# EAGLE design Universal Debugger Module (EAGLE 6.3)
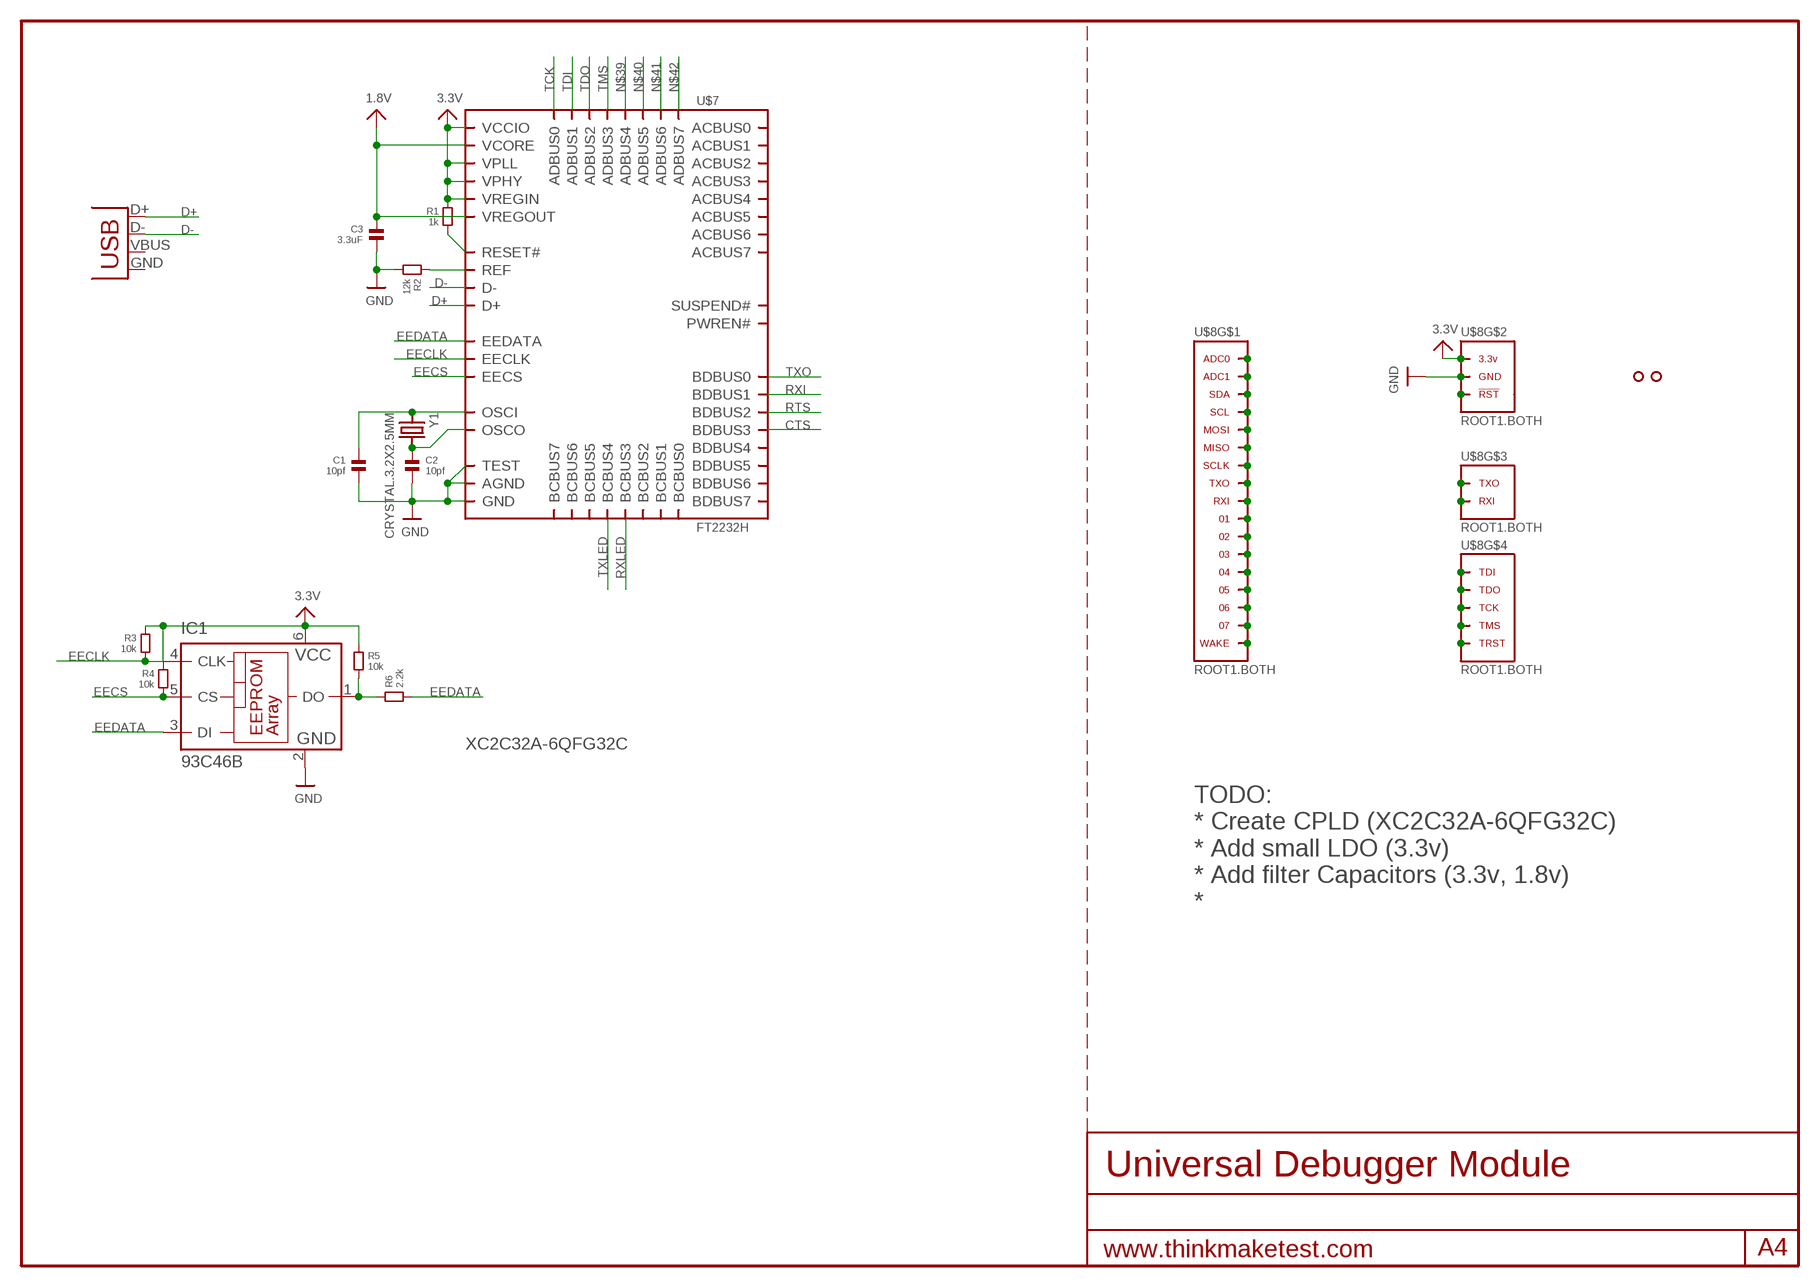
[diagram p0: schematic, sheet 1]

## Parts
C1  10pf  CAPACITOR.0603  [0603]
C2  10pf  CAPACITOR.0603  [0603]
C3  3.3uF  CAPACITOR.0603  [0603]
IC1  93C46B  93C76A  [SOT23-6]
R1  1k  RESISTOR.0603  [0603]
R2  12k  RESISTOR.0603  [0603]
R3  10k  RESISTOR.0603  [0603]
R4  10k  RESISTOR.0603  [0603]
R5  10k  RESISTOR.0603  [0603]
R6  2.2k  RESISTOR.0603  [0603]
U$3  HOLE.2MM  [2MM]
U$4  HOLE.2MM  [2MM]
U$7  FT2232H  [QFN64.PAD]
U$8  ROOT1.BOTH  [ROOT1.BOTH]
X1  USB-MICROB  [USB-MICROB]
Y1  CRYSTAL.3.2X2.5MM  [3.2X2.5MM]

## Nets
1.8V: C3.1 U$7.12(VCORE) U$7.37(VCORE) U$7.49(VREGOUT) U$7.64(VCORE)
3.3V: IC1.6(VCC) R1.1 R3.1 R4.1 R5.1 U$7.4(VPHY) U$7.9(VPLL) U$7.20(VCCIO) U$7.31(VCCIO) U$7.42(VCCIO) U$7.50(VREGIN) U$7.56(VCCIO) U$8.3.3V@1(3.3V) U$8.3.3V@2(3.3V) U$8.3.3V@3(3.3V) U$8.3.3V@4(3.3V) U$8.3.3V@5(3.3V) U$8.3.3V@6(3.3V) U$8.3.3V@7(3.3V) U$8.3.3V@8(3.3V) U$8.3.3V@9(3.3V) U$8.3.3V@10(3.3V) U$8.3.3V@11(3.3V) U$8.3.3V@12(3.3V) U$8.3.3V@13(3.3V) U$8.3.3V@14(3.3V) U$8.3.3V@15(3.3V) U$8.3.3V@16(3.3V) U$8.3.3V@17(3.3V) U$8.3.3V@18(3.3V) U$8.3.3V@19(3.3V) U$8.3.3V@20(3.3V) U$8.3.3V@21(3.3V) U$8.3.3V@22(3.3V) U$8.3.3V@23(3.3V) U$8.3.3V@24(3.3V) U$8.3.3V@VIA(3.3V)
CTS: U$7.41(BDBUS3)
D+: U$7.8(D+) X1.D+
D-: U$7.7(D-) X1.D-
EECLK: IC1.4(CLK) R3.2 U$7.62(EECLK)
EECS: IC1.5(CS) R4.2 U$7.63(EECS)
EEDATA: IC1.3(DI) R6.2 U$7.61(EEDATA)
GND: C1.2 C2.2 C3.2 IC1.2(GND) R2.2 U$7.1(GND) U$7.5(GND) U$7.10(AGND) U$7.11(GND) U$7.13(TEST) U$7.15(GND) U$7.25(GND) U$7.35(GND) U$7.47(GND) U$7.51(GND) U$7.PAD(GND) U$8.GND@1(GND) U$8.GND@2(GND) U$8.GND@3(GND) U$8.GND@4(GND) U$8.GND@5(GND) U$8.GND@6(GND) U$8.GND@7(GND) U$8.GND@8(GND) U$8.GND@9(GND) U$8.GND@10(GND) U$8.GND@11(GND) U$8.GND@12(GND) U$8.GND@13(GND) U$8.GND@14(GND) U$8.GND@15(GND) U$8.GND@16(GND) U$8.GND@17(GND) U$8.GND@18(GND) U$8.GND@19(GND) U$8.GND@20(GND) U$8.GND@21(GND) U$8.GND@22(GND) U$8.GND@23(GND) U$8.GND@24(GND) U$8.GND@25(GND) U$8.GND@26(GND) U$8.GND@VIA(GND)
N$1: U$8.ADC0 U$8.ADC0@1(ADC0) U$8.ADC0@VIA(ADC0)
N$2: U$8.ADC1 U$8.ADC1@1(ADC1) U$8.ADC1@VIA(ADC1)
N$3: U$8.SDA U$8.SDA@1(SDA) U$8.SDA@VIA(SDA)
N$4: U$8.SCL U$8.SCL@1(SCL) U$8.SCL@VIA(SCL)
N$5: U$8.MOSI U$8.MOSI@1(MOSI) U$8.MOSI@VIA(MOSI)
N$6: U$8.MISO U$8.MISO@1(MISO) U$8.MISO@VIA(MISO)
N$7: U$8.SCLK U$8.SCLK@1(SCLK) U$8.SCLK@VIA(SCLK)
N$8: U$8.01 U$8.01@1 U$8.01@VIA
N$9: U$8.02 U$8.02@1 U$8.02@VIA
N$10: U$8.03 U$8.03@1 U$8.03@VIA
N$11: U$8.04 U$8.04@1 U$8.04@VIA
N$12: U$8.05 U$8.05@1 U$8.05@VIA
N$13: U$8.06 U$8.06@1 U$8.06@VIA
N$14: U$8.07 U$8.07@1 U$8.07@VIA
N$15: U$8.WAKE U$8.WAKE@1(WAKE) U$8.WAKE@VIA(WAKE)
N$16: U$8.RXI U$8.RXI@1(RXI) U$8.RXI@VIA(RXI)
N$17: U$8.TXO U$8.TXO@1(TXO) U$8.TXO@VIA(TXO)
N$18: C2.1 U$7.3(OSCO) Y1.3
N$19: U$8.RST(!RST) U$8.RST@1(!RST) U$8.RST@VIA(!RST)
N$20: C1.1 U$7.2(OSCI) Y1.1
N$23: U$8.TRST U$8.TRST@1(TRST) U$8.TRST@VIA(TRST)
N$25: U$8.TMS U$8.TMS@1(TMS) U$8.TMS@VIA(TMS)
N$26: U$8.TCK U$8.TCK@1(TCK) U$8.TCK@VIA(TCK)
N$27: U$8.TDO U$8.TDO@1(TDO) U$8.TDO@VIA(TDO)
N$28: U$8.TDI U$8.TDI@1(TDI) U$8.TDI@VIA(TDI)
N$29: U$8.RXI.DBG(RXI) U$8.RXI.DBG@1(RXI) U$8.RXI.DBG@VIA(RXI)
N$31: U$8.TXO.DBG(TXO) U$8.TXO.DBG@1(TXO) U$8.TXO.DBG@VIA(TXO)
N$32: R2.1 U$7.6(REF)
N$33: R1.2 U$7.14(RESET#)
N$34: IC1.1(DO) R5.2 R6.1
N$39: U$7.21(ADBUS4)
N$40: U$7.22(ADBUS5)
N$41: U$7.23(ADBUS6)
N$42: U$7.24(ADBUS7)
RTS: U$7.40(BDBUS2)
RXI: U$7.39(BDBUS1)
RXLED: U$7.54(BCBUS3)
TCK: U$7.16(ADBUS0)
TDI: U$7.17(ADBUS1)
TDO: U$7.18(ADBUS2)
TMS: U$7.19(ADBUS3)
TXLED: U$7.55(BCBUS4)
TXO: U$7.38(BDBUS0)
Unconnected: U$7.26(ACBUS0) U$7.27(ACBUS1) U$7.28(ACBUS2) U$7.29(ACBUS3) U$7.30(ACBUS4) U$7.32(ACBUS5) U$7.33(ACBUS6) U$7.34(ACBUS7) U$7.36(SUSPEND#) U$7.43(BDBUS4) U$7.44(BDBUS5) U$7.45(BDBUS6) U$7.46(BDBUS7) U$7.48(BCBUS0) U$7.52(BCBUS1) U$7.53(BCBUS2) U$7.57(BCBUS5) U$7.58(BCBUS6) U$7.59(BCBUS7) U$7.60(PWREN#) X1.GND X1.VBUS

## Notes on the sheet
- XC2C32A-6QFG32C
- TODO:
  * Create CPLD (XC2C32A-6QFG32C)
  * Add small LDO (3.3v)
  * Add filter Capacitors (3.3v, 1.8v)
  *

## Library data of the parts
C1-C3 = .standardparts:CAPACITOR
IC1 = microchip:93*76?: 8K Microwire Compatible Serial EEPROM Source: http://ww1.microchip.com/downloads/en/DeviceDoc/21796H.pdf; OC_FARNELL: unknown; OC_NEWARK: unknown
R1-R6 = .standardparts:RESISTOR
U$3 U$4 = .screw_holes:HOLE
U$7 = ftdi:FT2232H
U$8 = thinkmaketest:ROOT1
X1 = SparkFun:USB: USB Connectors USB-B-PTH is fully proven SKU : PRT-00139 USB-miniB is fully proven SKU : PRT-00587 USB-A-PCB is untested. USB-A-H is throughly reviewed, but untested. Spark Fun Electronics SKU : PRT-00437 USB-B-SMT is throughly reviewed, but untested. Needs silkscreen touching up. USB-A-S has not been used/tested USB-MB-H has not been used/tested
Y1 = abracon:CRYSTAL

## Board
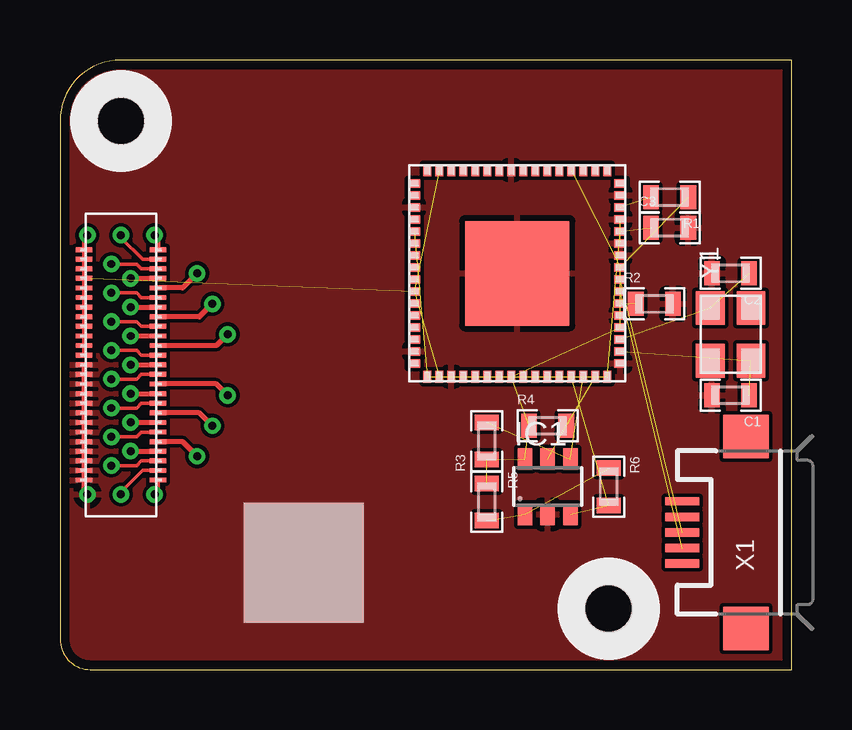
[diagram p1: board, top side]
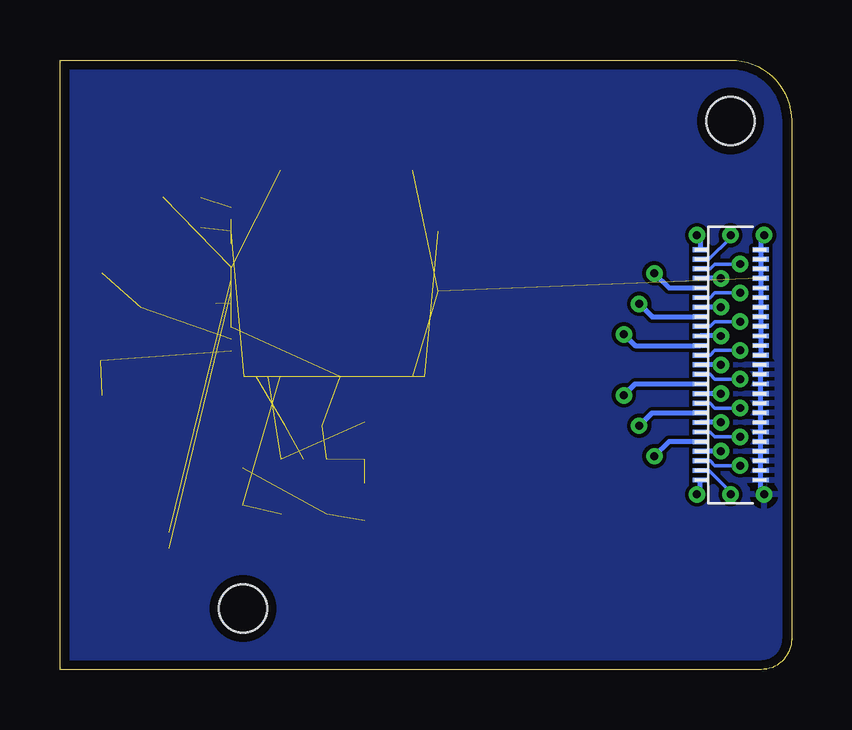
[diagram p2: board, bottom side, seen from below]

Size 30.48 x 25.4 mm. Coordinates in mm from the lower left corner, seen from the top.
Outline: 0,22.86 0,1.27 arc90 1.27,0 30.48,0 30.48,25.4 2.54,25.4 arc90 0,22.86
Copper layers (1*16): Top 0.0356mm / dielectric 1.5011mm / Bottom 0.0356mm
Design rules "default": minimum track width 6mil, minimum drill 13mil, track to track 6mil, track to pad 6mil, pad to pad 6mil, via to via 6mil, smd to smd 6mil, copper to edge 15mil, drill to drill 6mil, minimum pad ring 7mil, minimum via ring 7mil, stop-mask expansion 4mil, vias tented up to drill 16mil, thermal gap 10mil

### Footprints (pad centres in the part's own frame; a part is rotated, then mirrored left to right if it is on the bottom)
0603 = smd 0.65 x 1: 1 -0.775,0; 2 0.775,0
SOT23-6 = smd 0.6 x 0.9: 1 -0.95,-1.15; 2 0,-1.15; 3 0.95,-1.15; 4 0.95,1.15; 5 0,1.15; 6 -0.95,1.15
2MM = hole 2: 0,0
QFN64.PAD = smd 0.5 x 0.35: 1 -4.3,3.75; 2 -4.3,3.25; 3 -4.3,2.75; 4 -4.3,2.25; 5 -4.3,1.75; 6 -4.3,1.25; 7 -4.3,0.75; 8 -4.3,0.25; 9 -4.3,-0.25; 10 -4.3,-0.75; 11 -4.3,-1.25; 12 -4.3,-1.75; 13 -4.3,-2.25; 14 -4.3,-2.75; 15 -4.3,-3.25; 16 -4.3,-3.75; 33 4.3,-3.75; 34 4.3,-3.25; 35 4.3,-2.75; 36 4.3,-2.25; 37 4.3,-1.75; 38 4.3,-1.25; 39 4.3,-0.75; 40 4.3,-0.25; 41 4.3,0.25; 42 4.3,0.75; 43 4.3,1.25; 44 4.3,1.75; 45 4.3,2.25; 46 4.3,2.75; 47 4.3,3.25; 48 4.3,3.75 | smd 0.35 x 0.5: 17 -3.75,-4.3; 18 -3.25,-4.3; 19 -2.75,-4.3; 20 -2.25,-4.3; 21 -1.75,-4.3; 22 -1.25,-4.3; 23 -0.75,-4.3; 24 -0.25,-4.3; 25 0.25,-4.3; 26 0.75,-4.3; 27 1.25,-4.3; 28 1.75,-4.3; 29 2.25,-4.3; 30 2.75,-4.3; 31 3.25,-4.3; 32 3.75,-4.3; 49 3.75,4.3; 50 3.25,4.3; 51 2.75,4.3; 52 2.25,4.3; 53 1.75,4.3; 54 1.25,4.3; 55 0.75,4.3; 56 0.25,4.3; 57 -0.25,4.3; 58 -0.75,4.3; 59 -1.25,4.3; 60 -1.75,4.3; 61 -2.25,4.3; 62 -2.75,4.3; 63 -3.25,4.3; 64 -3.75,4.3 | smd 4.35 x 4.35: PAD 0,0
ROOT1.BOTH = smd 0.66 x 0.2 bottom: 01 3.795,13.9; 02 3.795,13.5; 03 3.795,13.1; 3.3V@1 1.285,17.5; 3.3V@2 1.285,17.1; 3.3V@3 1.285,16.7; 3.3V@4 1.285,16.3; 3.3V@5 1.285,15.9; 3.3V@6 1.285,15.5; 3.3V@7 1.285,15.1; 3.3V@8 1.285,14.7; 3.3V@9 1.285,14.3; 3.3V@10 1.285,13.9; 3.3V@11 1.285,13.5; 3.3V@12 1.285,13.1; 04 3.795,12.7; 05 3.795,12.3; 06 3.795,11.9; 07 3.795,11.5; ADC0 3.795,17.5; ADC1 3.795,17.1; GND@1 1.285,7.9; GND@2 1.285,8.3; GND@3 1.285,8.7; GND@4 1.285,9.1; GND@5 1.285,9.5; GND@6 1.285,9.9; GND@7 1.285,10.3; GND@8 1.285,10.7; GND@9 1.285,11.1; GND@10 1.285,11.5; GND@11 1.285,11.9; GND@12 1.285,12.3; GND@13 1.285,12.7; MISO 3.795,15.5; MOSI 3.795,15.9; RST 3.795,7.9; RXI 3.795,14.3; RXI.DBG 3.795,10.3; SCL 3.795,16.3; SCLK 3.795,15.1; SDA 3.795,16.7; TCK 3.795,9.1; TDI 3.795,9.9; TDO 3.795,9.5; TMS 3.795,8.7; TRST 3.795,8.3; TXO 3.795,14.7; TXO.DBG 3.795,10.7; WAKE 3.795,11.1 | smd 0.7 x 0.2: 01@1 4.08,13.9; 02@1 4.08,13.5; 3.3V@13 1,17.5; 3.3V@14 1,17.1; 3.3V@15 1,16.7; 3.3V@16 1,16.3; 3.3V@17 1,15.9; 3.3V@18 1,15.5; 3.3V@19 1,15.1; 3.3V@20 1,14.7; 3.3V@21 1,14.3; 3.3V@22 1,13.9; 3.3V@23 1,13.5; 3.3V@24 1,13.1; 03@1 4.08,13.1; 04@1 4.08,12.7; 05@1 4.08,12.3; 06@1 4.08,11.9; 07@1 4.08,11.5; ADC0@1 4.08,17.5; ADC1@1 4.08,17.1; GND@14 1,7.9; GND@15 1,8.3; GND@16 1,8.7; GND@17 1,9.1; GND@18 1,9.5; GND@19 1,9.9; GND@20 1,10.3; GND@21 1,10.7; GND@22 1,11.1; GND@23 1,11.5; GND@24 1,11.9; GND@25 1,12.3; GND@26 1,12.7; MISO@1 4.08,15.5; MOSI@1 4.08,15.9; RST@1 4.08,7.9; RXI.DBG@1 4.08,10.3; RXI@1 4.08,14.3; SCL@1 4.08,16.3; SCLK@1 4.08,15.1; SDA@1 4.08,16.7; TCK@1 4.08,9.1; TDI@1 4.08,9.9; TDO@1 4.08,9.5; TMS@1 4.08,8.7; TRST@1 4.08,8.3; TXO.DBG@1 4.08,10.7; TXO@1 4.08,14.7; WAKE@1 4.08,11.1 | drill 0.33 pad 0.686: 01@VIA 2.94,13.9; 02@VIA 6.985,13.97; 3.3V@VIA 1.14,18.1; 03@VIA 2.14,13.3; 04@VIA 2.94,12.7; 05@VIA 2.14,12.1; 06@VIA 6.985,11.43; 07@VIA 2.94,11.5; ADC0@VIA 3.94,18.1; ADC1@VIA 2.54,18.1; GND@VIA 1.14,7.3; MISO@VIA 2.14,15.7; MOSI@VIA 5.715,16.51; RST@VIA 3.94,7.3; RXI.DBG@VIA 2.94,10.3; RXI@VIA 2.14,14.5; SCL@VIA 2.94,16.3; SCLK@VIA 2.94,15.1; SDA@VIA 2.14,16.9; TCK@VIA 2.94,9.1; TDI@VIA 2.14,9.7; TDO@VIA 5.715,8.89; TMS@VIA 2.14,8.5; TRST@VIA 2.54,7.3; TXO.DBG@VIA 6.35,10.16; TXO@VIA 6.35,15.24; WAKE@VIA 2.14,10.9
USB-MICROB = smd 0.35 x 1.4: D+ 0,2.65; D- -0.65,2.65; GND 1.3,2.65; ID 0.65,2.65; VBUS -1.3,2.65 | smd 1.8 x 1.9: MT1 -4,0; MT2 4,0
3.2X2.5MM = smd 1.4 x 1.2: 1 -1.1,-0.85; 2 1.1,-0.85; 3 1.1,0.85; 4 -1.1,0.85

### Placement (x,y rotation side)
C1  27.94,11.43 180 top
C2  27.94,16.51 180 top
C3  25.4,18.41 0 top
IC1  20.32,7.62 0 top
R1  25.4,19.68 180 top
R2  24.77,15.24 0 top
R3  17.78,9.53 90 top
R4  20.32,10.16 0 top
R5  17.78,6.99 270 top
R6  22.86,7.62 270 top
U$3  22.86,2.54 90 top
U$4  2.54,22.86 90 top
U$7  19.05,16.51 180 top
U$8  0,0 0 top
X1  28.57,5.71 90 top
Y1  27.94,13.97 90 top

### Tracks (layer width: path | path; a pad name or v marks a point on that pad's centre or on a via)
1.8V  (4 unrouted)
3.3V  (12 unrouted)
D+  (1 unrouted)
D-  (1 unrouted)
EECLK  (2 unrouted)
EECS  (2 unrouted)
EEDATA  (2 unrouted)
GND  (1 unrouted)
  pour Bottom (rank 6): 0,0 30.48,0 30.48,25.4 0,25.4
  pour Top (rank 6): 0,0 30.48,0 30.48,25.4 0,25.4
N$18  (2 unrouted)
N$20  (2 unrouted)
N$32  (1 unrouted)
N$33  (1 unrouted)
N$34  (2 unrouted)